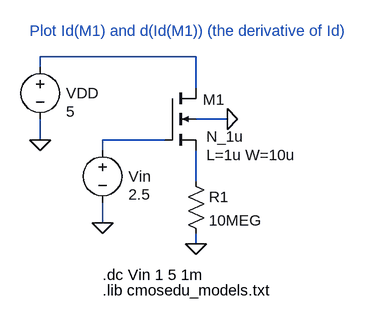
[diagram p0: schematic Fig9_14.asc]
Fig9_14.asc, the LTspice schematic file:
Version 4
SHEET 1 1184 680
WIRE 480 -48 480 -64
WIRE 480 64 480 32
WIRE 576 80 576 64
WIRE 576 192 576 160
WIRE 672 64 576 64
WIRE 720 -64 480 -64
WIRE 720 -16 720 -64
WIRE 720 128 720 80
WIRE 720 224 720 208
WIRE 768 32 720 32
FLAG 720 224 0
FLAG 768 32 0
FLAG 480 64 0
FLAG 576 192 0
SYMBOL voltage 480 -64 R0
WINDOW 0 40 56 Left 0
WINDOW 3 40 84 Left 0
WINDOW 123 0 0 Left 0
WINDOW 39 0 0 Left 0
SYMATTR InstName VDD
SYMATTR Value 5
SYMBOL nmos4 672 -16 R0
WINDOW 0 59 18 Left 0
WINDOW 3 64 75 Left 0
WINDOW 123 64 103 Left 0
SYMATTR InstName M1
SYMATTR Value N_1u
SYMATTR Value2 L=1u W=10u
SYMBOL res 704 112 R0
SYMATTR InstName R1
SYMATTR Value 10MEG
SYMBOL voltage 576 64 R0
WINDOW 0 40 56 Left 0
WINDOW 3 40 84 Left 0
WINDOW 123 0 0 Left 0
WINDOW 39 0 0 Left 0
SYMATTR InstName Vin
SYMATTR Value 2.5
TEXT 576 272 Left 0 !.dc Vin 1 5 1m
TEXT 576 296 Left 0 !.lib cmosedu_models.txt
TEXT 464 -104 Left 0 ;Plot Id(M1) and d(Id(M1)) (the derivative of Id)

The netlist it stands for:
* Fig9_14.asc
VDD N001 0 5
M1 N001 N002 N003 0 N_1u L=1u W=10u
R1 N003 0 10MEG
Vin N002 0 2.5
.model NMOS NMOS
.model PMOS PMOS
.lib standard.mos
.dc Vin 1 5 1m
.lib cmosedu_models.txt
* Plot Id(M1) and d(Id(M1)) (the derivative of Id)
.backanno
.end